# Altium schematic sheet FV-1.SchDoc
size A4
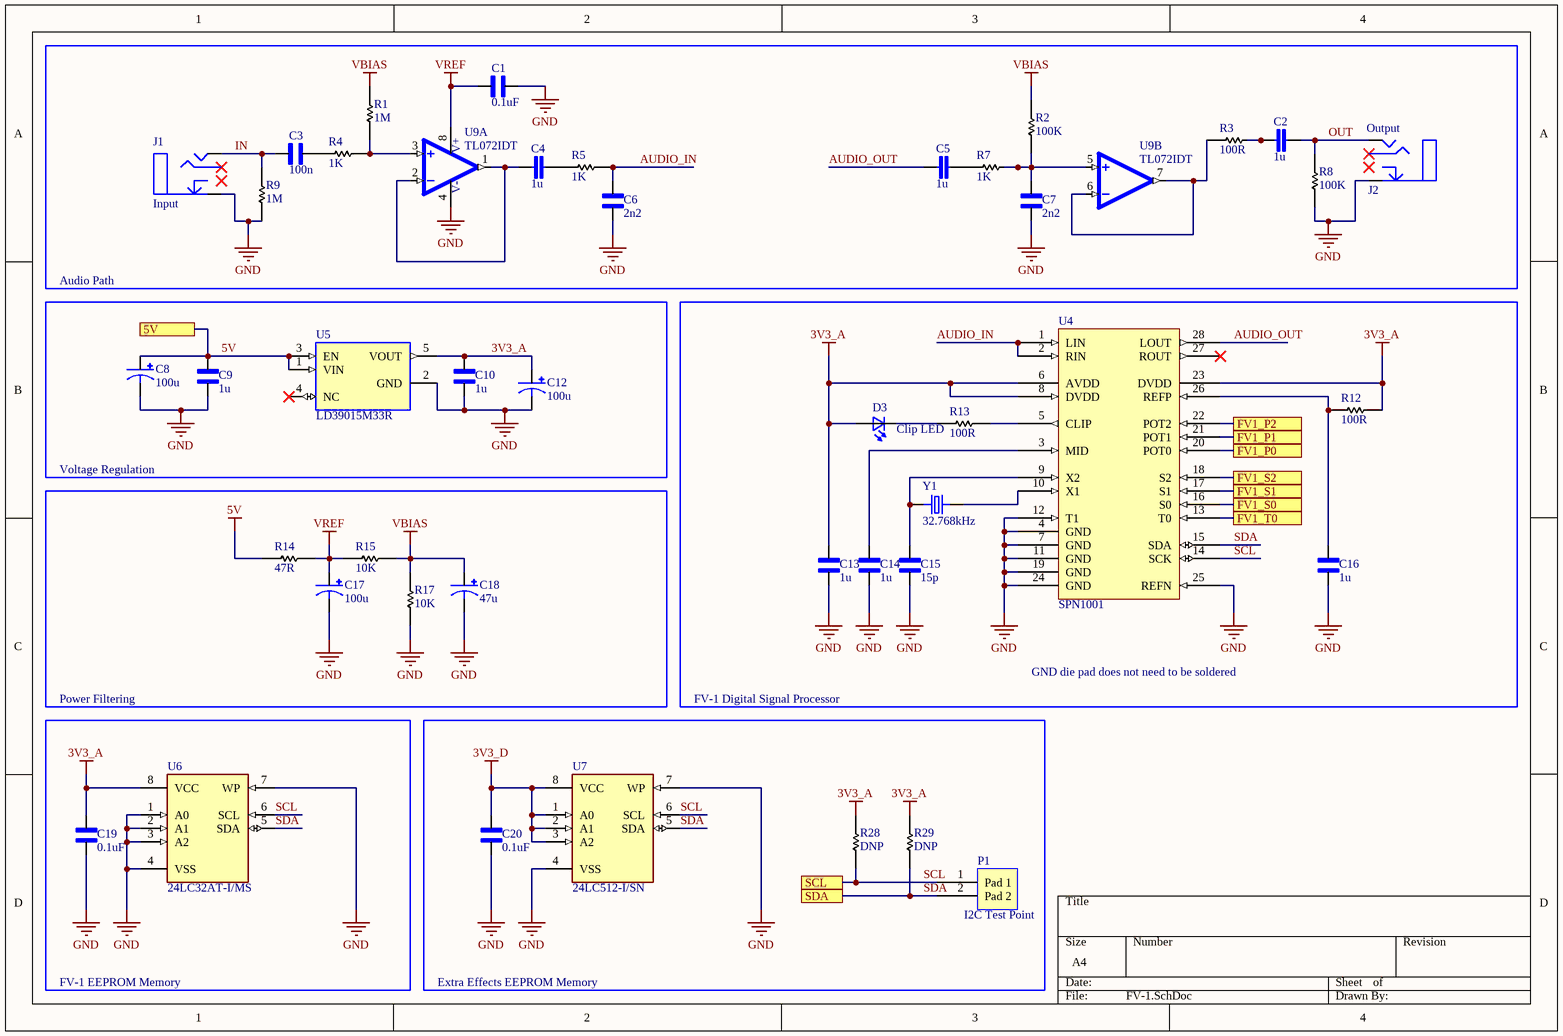
[diagram p0: FV-1.SchDoc]

## Parts
C1  0.1uF  [CHIP_0603]
C2  1u  [CHIP_1210]
C3  100n  [CAPC3216X180N]
C4  1u  [CHIP_1210]
C5  1u  [CHIP_1210]
C6  2n2  [CHIP_0603]
C7  2n2  [CHIP_0603]
C8  100u  [UCD1E101MCL1GS]
C9  1u  [CHIP_0603]
C10  1u  [CHIP_0603]
C12  100u  [UCD1E101MCL1GS]
C13  1u  [CHIP_0603]
C14  1u  [CHIP_0603]
C15  15p  [CHIP_0603]
C16  1u  [CHIP_0603]
C17  100u  [UCD1E101MCL1GS]
C18  47u  [EEE1EA470WAP]
C19  0.1uF  [CHIP_0603]
C20  0.1uF  [CHIP_0603]
D3  Clip LED  [0603 LED Generic]
J1  Input  [2 Test Points]
J2  Output  [2 Test Points]
P1  I2C Test Point  [2 Test Points]
R1  1M  [CHIP_R_0603]
R2  100K  [CHIP_R_0603]
R3  100R  [CHIP_R_0603]
R4  1K  [CHIP_R_0603]
R5  1K  [CHIP_R_0603]
R7  1K  [CHIP_R_0603]
R8  100K  [CHIP_R_0603]
R9  1M  [CHIP_R_0603]
R12  100R  [CHIP_R_0603]
R13  100R  [CHIP_R_0603]
R14  47R  [CHIP_R_0603]
R15  10K  [CHIP_R_0603]
R17  10K  [CHIP_R_0603]
R28  DNP  [CHIP_R_0603]
R29  DNP  [CHIP_R_0603]
U4  SPN1001  [SOIC-28]
U5  LD39015M33R  [SOT-23]
U6  24LC32AT-I/MS  [24LC32AT-I/MS]
U7  24LC512-I/SN  [24LC512-I/SN]
U9  TL072IDT  [TL072BIDT]  (parts A,B of 2)
Y1  32.768kHz  [XTAL_ABS07-32.768KHZ-T]

## Blocks framed on the sheet
Audio Path: C1-C7 J1 J2 R1-R5 R7-R9 U9

## Ports
5V, FV1_P0, FV1_P1, FV1_P2, FV1_S0, FV1_S1, FV1_S2, FV1_T0, SCL, SDA

## Nets
3V3_A: C10.1 C12.+ C13.1 C19.1 D3.2(A2) R12.2 R28.1 R29.1 U4.6(AVDD) U4.8(DVDD) U4.23(DVDD) U5.5(VOUT) U6.8(VCC)
3V3_D: C20.1 U7.1(A0) U7.2(A1) U7.3(A2) U7.8(VCC)
5V: C8.+ C9.1 R14.2 U5.1(VIN) U5.3(EN) ; port 5V
GND: C1.2 C6.2 C7.2 C8.- C9.2 C10.2 C12.- C13.2 C14.2 C15.2 C16.2 C17.- C18.- C19.2 C20.2 J1.2 J2.2 R8.2 R9.2 R17.2 U4.4(GND) U4.7(GND) U4.11(GND) U4.12(T1) U4.19(GND) U4.24(GND) U4.25(REFN) U5.2(GND) U6.1(A0) U6.2(A1) U6.3(A2) U6.4(VSS) U6.7(WP) U7.4(VSS) U7.7(WP) U9.4(V-)
VBIAS: C18.+ R1.1 R2.1 R15.1 R17.1
VREF: C1.1 C17.+ R14.1 R15.2 U9.8(V+)
AUDIO_IN: C6.1 R5.2 U4.1(LIN) U4.2(RIN)
AUDIO_OUT: C5.2 U4.28(LOUT)
FV1_P0: U4.20(POT0) ; port FV1_P0
FV1_P1: U4.21(POT1) ; port FV1_P1
FV1_P2: U4.22(POT2) ; port FV1_P2
FV1_S0: U4.16(S0) ; port FV1_S0
FV1_S1: U4.17(S1) ; port FV1_S1
FV1_S2: U4.18(S2) ; port FV1_S2
FV1_T0: U4.13(T0) ; port FV1_T0
IN: C3.2 J1.1 R9.1
OUT: C2.1 J2.1 R8.1
SCL: P1.1(Pad_1) R28.2 U4.14(SCK) U6.6(SCL) U7.6(SCL) ; port SCL
SDA: P1.2(Pad_2) R29.2 U4.15(SDA) U6.5(SDA) U7.5(SDA) ; port SDA
NetC2_2: C2.2 R3.2
NetC3_1: C3.1 R4.1
NetC4_1: C4.1 R5.1
NetC4_2: C4.2 U9.1(OUT1) U9.2(-IN1)
NetC5_1: C5.1 R7.1
NetC7_1: C7.1 R2.2 R7.2 U9.5(+IN2)
NetC14_1: C14.1 U4.3(MID)
NetC15_1: C15.1 U4.9(X2) Y1.2
NetC16_1: C16.1 R12.1 U4.26(REFP)
NetD3_1: D3.1(K2) R13.1
NetR1_2: R1.2 R4.2 U9.3(+IN1)
NetR3_1: R3.1 U9.6(-IN2) U9.7(OUT2)
NetR13_2: R13.2 U4.5(CLIP)
NetU4_10: U4.10(X1) Y1.1

Not connected (* = marked no-connect by the designer): U4 27(ROUT)*; U5 4(NC)*

## Notes on the sheet
- Voltage Regulation
- Power Filtering
- FV-1 Digital Signal Processor
- GND die pad does not need to be soldered
- FV-1 EEPROM Memory
- Extra Effects EEPROM Memory

## Library data of the parts
C1 C9 C10 C13-C16 C19 C20 = 0603 Ceramic Capacitor: Generic 0603 Ceramic Capacitor; MP: AC0402FR-071ML; MF: Yageo; Package: 1005 Yageo; SnapEDA_Link: https://www.snapeda.com/parts/AC0402FR-071ML/Yageo/view-part/940461/?ref=snap; Value: *; Mouser-Purchase-URL: https://snapeda.com/shop?store=Mouser&id=940461; DigiKey-Purchase-URL: https://snapeda.com/shop?store=DigiKey&id=940461
C2 C4 C5 = ECP-U1C105MA5: CAP FILM 1UF 16V 20%; Manufacturer: Panasonic; Dielectric: PPS; Dissipation Factor: 1.5%; Insulation Resistance: 300MR; Supplier 1: Farnell; Supplier Part Number 1: 9694315; Manufacturer Part Number: ECP-U1C105MA5; RoHS: Yes; Category: Film Capacitors; Stock: 7744; Pricing: 5=0.65900, 50=0.39900, 250=0.33300, 500=0.27300, 1000=0.26400 (EUR); Mount: Surface Mount; Case/Package: 1210; Number of Pins: 2; Case Code (Metric): 3225; Contact Plating: Copper,Tin,Silver; Case Code (Imperial): 1210; Min Operating Temperature: -40°C; Max Operating Temperature: 85°C; Capacitance: 1uF; Tolerance: 20%; Termination: SMD/SMT; Voltage: 16V; Packaging: Tape and Reel; Package Quantity: 1; Voltage Rating: 16V; Voltage Rating (DC): 16V; Length: 3.2mm; Height: 1.4mm; Depth: 2.5mm; Height - Seated (Max): 0.063inch; Width: 2.5mm; Radiation Hardening: No; Lead Free: Lead Free; REACH SVHC: No SVHC; ComponentLink1URL: https://datasheet.ciiva.com/24023/abd0000ce12-181823-24023616.pdf?src-supplier=Mouser; ComponentLink1Description: https://datasheet.ciiva.com/24023/abd0000ce12-181823-24023616.pdf?src-supplier=Mouser; ComponentLink2URL: https://datasheet.ciiva.com/34303/1983192-34303533.pdf?src-supplier=Jameco; ComponentLink2Description: https://datasheet.ciiva.com/34303/1983192-34303533.pdf?src-supplier=Jameco; ComponentLink3URL: https://datasheet.ciiva.com/11790/0900766b80f2ea72-11790686.pdf?src-supplier=RSComponents; ComponentLink3Description: https://datasheet.ciiva.com/11790/0900766b80f2ea72-11790686.pdf?src-supplier=RSComponents; ComponentLink4URL: https://datasheet.ciiva.com/2992/abd0000ce12-2992994.pdf?src-supplier=Avnet; ComponentLink4Description: https://datasheet.ciiva.com/2992/abd0000ce12-2992994.pdf?src-supplier=Avnet; ComponentLink5URL: https://datasheet.ciiva.com/2992/abd0000ce12-2992995.pdf?src-supplier=Avnet; ComponentLink5Description: https://datasheet.ciiva.com/2992/abd0000ce12-2992995.pdf?src-supplier=Avnet; ComponentLink6URL: https://datasheet.ciiva.com/46399/31740-46399788.pdf?src-supplier=Element14; ComponentLink6Description: https://datasheet.ciiva.com/46399/31740-46399788.pdf?src-supplier=Element14; ComponentLink7URL: https://datasheet.ciiva.com/16433/abd0000ce12-16433502.pdf?src-supplier=Future+Electronics; ComponentLink7Description: https://datasheet.ciiva.com/16433/abd0000ce12-16433502.pdf?src-supplier=Future+Electronics; ComponentLink8URL: https://datasheet.ciiva.com/5710/31740-5710134.pdf?src-supplier=Farnell; ComponentLink8Description: https://datasheet.ciiva.com/5710/31740-5710134.pdf?src-supplier=Farnell; ComponentLink9URL: https://datasheet.ciiva.com/30120/abd0000ce12-30120298.pdf?src-supplier=Onlinecomponents.com; ComponentLink9Description: https://datasheet.ciiva.com/30120/abd0000ce12-30120298.pdf?src-supplier=Onlinecomponents.com; ComponentLink10URL: https://datasheet.ciiva.com/46399/31740-46399787.pdf?src-supplier=Element14; ComponentLink10Description: https://datasheet.ciiva.com/46399/31740-46399787.pdf?src-supplier=Element14; ComponentLink11URL: https://datasheet.ciiva.com/15164/getdatasheetpartid-292104-15164029.pdf?src-supplier=Verical; ComponentLink11Description: https://datasheet.ciiva.com/15164/getdatasheetpartid-292104-15164029.pdf?src-supplier=Verical
C3 = GRM31C5C1H104JA01L: 50V 100nF C0G ±5% 1206 Multilayer Ceramic Capacitors
C6 C7 = GRM1885C1H222JA01D: 2200PF 50V C0G/NP0 0603
C8 C12 C17 = UCD1E101MCL1GS: CAP ALUM 100UF 25V SMD; ComponentLink1URL: http://www.farnell.com/datasheets/2151198.pdf?src-supplier=Element14; ComponentLink1Description: http://www.farnell.com/datasheets/2151198.pdf?src-supplier=Element14
C18 = EEE1EA470WAP: CAP ALUM 47UF 25V SMD; ComponentLink1URL: http://www.farnell.com/datasheets/2151198.pdf?src-supplier=Farnell; ComponentLink1Description: http://www.farnell.com/datasheets/2151198.pdf?src-supplier=Farnell; ComponentLink2URL: http://www.farnell.com/datasheets/2151198.pdf?src-supplier=Element14; ComponentLink2Description: http://www.farnell.com/datasheets/2151198.pdf?src-supplier=Element14
D3 = 0603 Generic LED: Value: *
J1 J2 = Audio_Solder_Pads: Sodler pads for audio jacks; Price: 0.5
P1 = Double Test Point
R1-R5 R7-R9 R12-R15 R17 R28 R29 = 0603 Generic Resistor: Generic 0603 Resistor
U5 = LD39015M33R: Fixed 3.3V LDO 150mA SOT-23-5 Linear Voltage Regulator
U6 = 24LC32AT-I/MS: 32K I2C Serial EEPROM
U7 = 24LC512-I/SN: 512K I2C Serial EEPROM
U9 = TL072IDT: J-FET Amplifier 2 Circuit 8-SO; MF: STMicroelectronics; Availability: Unavailable; Value: *; Price: None; SnapEDA_Link: https://www.snapeda.com/parts/TL072IDT/STMicroelectronics/view-part/265326/?ref=snap; MP: TL072IDT; Package: SOIC-8 STMicroelectronics
Y1 = ABS07-32.768KHZ-T: 32.768kHz Â±20ppm Crystal 12.5pF 70 kOhms 2-SMD, No Lead; MF: Abracon LLC; Price: None; Value: *; Package: SMD-2 Abracon; Availability: Unavailable; SnapEDA_Link: https://www.snapeda.com/parts/ABS07-32.768KHZ/Abracon%20LLC/view-part/448682/?ref=snap; MP: ABS07-32.768KHZ